# EAGLE design drutest2 (EAGLE 6.0)
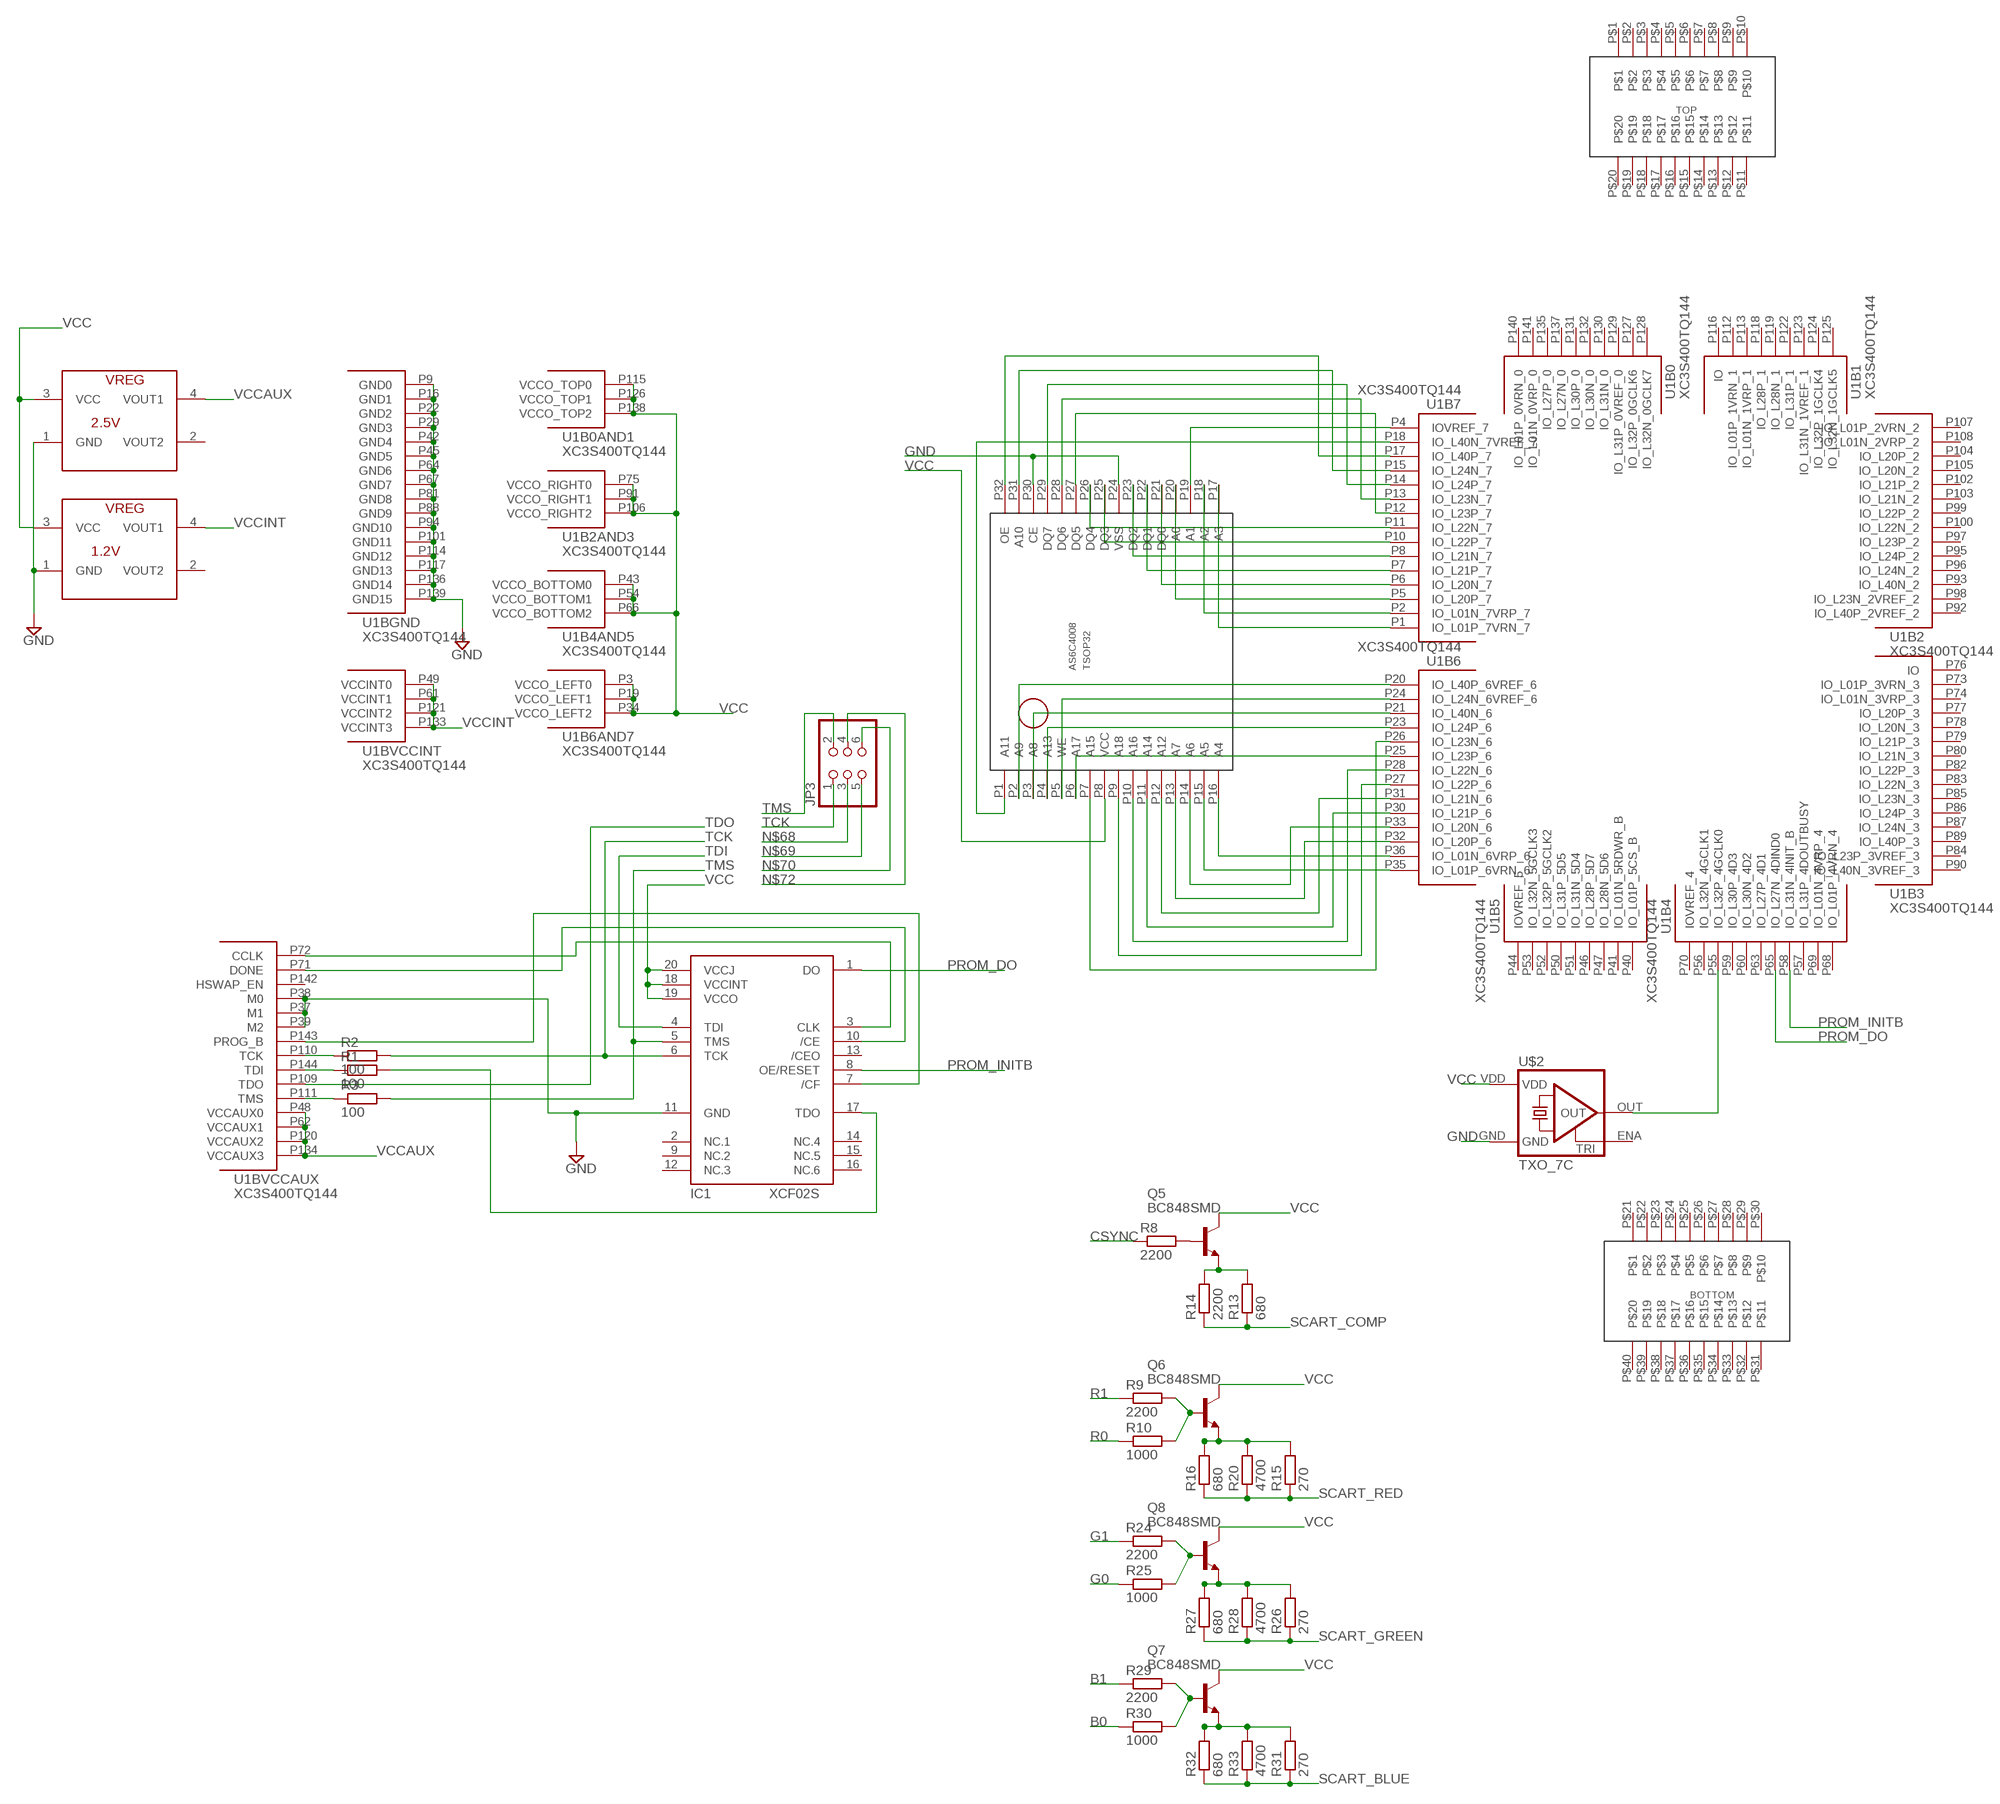
[diagram p0: schematic, sheet 1, part 1 of 2]
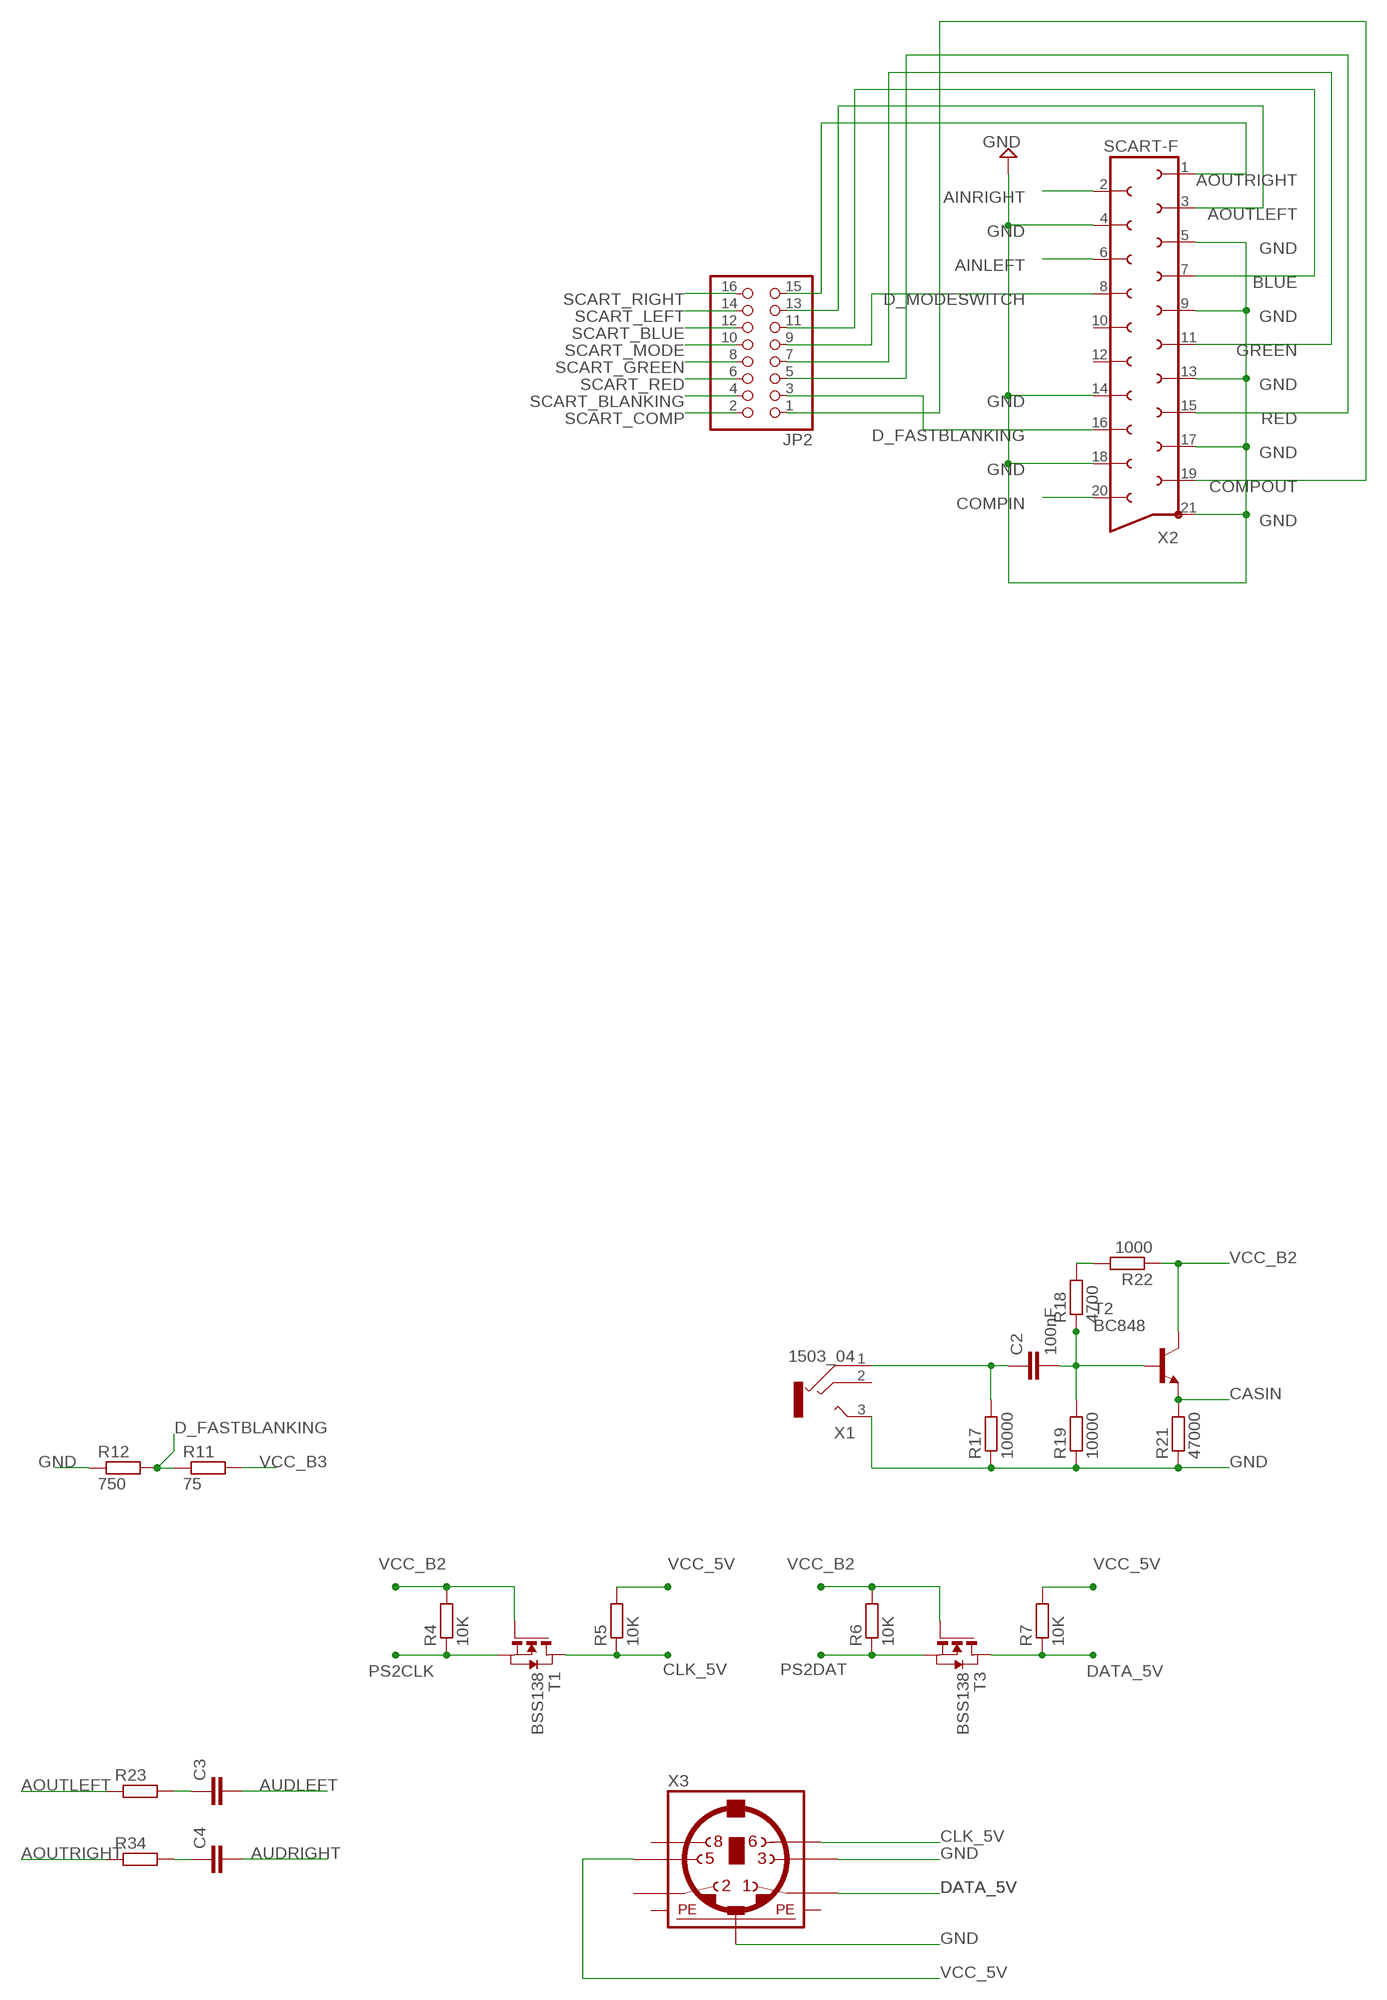
[diagram p1: schematic, sheet 1, part 2 of 2]

## Parts
C2  100nF  C-EUC0603  [C0603]
C3  C-EUC0603  [C0603]
C4  C-EUC0603  [C0603]
IC1  XCF02S  [VO20]
JP2  PINHD-2X8  [2X08]
JP3  PINHD-2X3  [2X03]
Q5  BC848SMD  [SOT23]
Q6  BC848SMD  [SOT23]
Q7  BC848SMD  [SOT23]
Q8  BC848SMD  [SOT23]
R1  100  R-EU_R0805  [R0805]
R2  100  R-EU_R0805  [R0805]
R3  100  R-EU_R0805  [R0805]
R4  10K  R-EU_R0805  [R0805]
R5  10K  R-EU_R0805  [R0805]
R6  10K  R-EU_R0805  [R0805]
R7  10K  R-EU_R0805  [R0805]
R8  2200  R-EU_R0805  [R0805]
R9  2200  R-EU_R0805  [R0805]
R10  1000  R-EU_R0805  [R0805]
R11  75  R-EU_R0805  [R0805]
R12  750  R-EU_R0805  [R0805]
R13  680  R-EU_R0805  [R0805]
R14  2200  R-EU_R0805  [R0805]
R15  270  R-EU_R0805  [R0805]
R16  680  R-EU_R0805  [R0805]
R17  10000  R-EU_R0805  [R0805]
R18  4700  R-EU_R0805  [R0805]
R19  10000  R-EU_R0805  [R0805]
R20  4700  R-EU_R0805  [R0805]
R21  47000  R-EU_R0805  [R0805]
R22  1000  R-EU_R0805  [R0805]
R23  R-EU_M0805  [M0805]
R24  2200  R-EU_R0805  [R0805]
R25  1000  R-EU_R0805  [R0805]
R26  270  R-EU_R0805  [R0805]
R27  680  R-EU_R0805  [R0805]
R28  4700  R-EU_R0805  [R0805]
R29  2200  R-EU_R0805  [R0805]
R30  1000  R-EU_R0805  [R0805]
R31  270  R-EU_R0805  [R0805]
R32  680  R-EU_R0805  [R0805]
R33  4700  R-EU_R0805  [R0805]
R34  R-EU_M0805  [M0805]
T1  BSS138  NMOSSOT23  [SOT-23]
T2  BC848  [SOT23]
T3  BSS138  NMOSSOT23  [SOT-23]
U1  XC3S400TQ144  [TQ144]
U$1  AS6C4008  [TSOP32]
U$2  TXO_7C  [OSC_7C]
U$3  2.5V  NX1117  [SOT223]
U$4  1.2V  NX1117  [SOT223]
U$5  EXPHDR  [EXPHDR]
X1  1503_04  [1503_04]
X2  SCART-F  [SCART-F]
X3  MINI_DIN_6  [M_DIN6]

## Nets
AINLEFT: X2.6
AINRIGHT: X2.2
AOUTLEFT: JP2.13 R23.1 X2.3
AOUTRIGHT: JP2.15 R34.1 X2.1
AUDLEFT: C3.2
AUDRIGHT: C4.2
B0: R30.1
B1: R29.1
BLUE: JP2.11 X2.7
CASIN: R21.2 T2.2(E)
CLK_5V: R5.1 T1.1(D) X3.6
COMPIN: X2.20
COMPOUT: JP2.1 X2.19
CSYNC: R8.1
D_FASTBLANKING: JP2.3 R11.1 R12.2 X2.16
D_MODESWITCH: JP2.9 X2.8
DATA_5V: R7.1 T3.1(D) X3.1
G0: R25.1
G1: R24.1
GND: IC1.11(GND) R12.1 R17.1 R19.1 R21.1 U1.P9(BGND:GND0) U1.P16(BGND:GND1) U1.P22(BGND:GND2) U1.P29(BGND:GND3) U1.P37(BVCCAUX:M1) U1.P38(BVCCAUX:M0) U1.P39(BVCCAUX:M2) U1.P42(BGND:GND4) U1.P45(BGND:GND5) U1.P64(BGND:GND6) U1.P67(BGND:GND7) U1.P81(BGND:GND8) U1.P88(BGND:GND9) U1.P94(BGND:GND10) U1.P101(BGND:GND11) U1.P114(BGND:GND12) U1.P117(BGND:GND13) U1.P136(BGND:GND14) U1.P139(BGND:GND15) U$1.P24(VSS) U$1.P30(CE) U$2.GND U$3.1(GND) U$4.1(GND) X1.3 X2.4 X2.5 X2.9 X2.13 X2.14 X2.17 X2.18 X2.21 X3.3 X3.SH2(PE2)
GREEN: JP2.7 X2.11
N$1: U1.P1(B7:IO_L01P_7VRN_7) U$1.P17(A3)
N$2: U1.P2(B7:IO_L01N_7VRP_7) U$1.P18(A2)
N$3: U1.P4(B7:IOVREF_7) U$1.P19(A1)
N$4: U1.P5(B7:IO_L20P_7) U$1.P20(A0)
N$5: U1.P6(B7:IO_L20N_7) U$1.P21(DQ0)
N$6: U1.P7(B7:IO_L21P_7) U$1.P22(DQ1)
N$7: U1.P8(B7:IO_L21N_7) U$1.P23(DQ2)
N$8: U1.P10(B7:IO_L22P_7) U$1.P25(DQ3)
N$9: U1.P11(B7:IO_L22N_7) U$1.P26(DQ4)
N$10: U1.P12(B7:IO_L23P_7) U$1.P27(DQ5)
N$11: U1.P13(B7:IO_L23N_7) U$1.P28(DQ6)
N$12: U1.P14(B7:IO_L24P_7) U$1.P29(DQ7)
N$13: U1.P15(B7:IO_L24N_7) U$1.P31(A10)
N$14: U1.P17(B7:IO_L40P_7) U$1.P32(OE)
N$15: U1.P18(B7:IO_L40N_7VREF_7) U$1.P1(A11)
N$16: U1.P20(B6:IO_L40P_6VREF_6) U$1.P2(A9)
N$17: U1.P21(B6:IO_L40N_6) U$1.P3(A8)
N$18: U1.P23(B6:IO_L24P_6) U$1.P4(A13)
N$19: U1.P24(B6:IO_L24N_6VREF_6) U$1.P5(WE)
N$20: U1.P25(B6:IO_L23P_6) U$1.P6(A17)
N$21: U1.P26(B6:IO_L23N_6) U$1.P7(A15)
N$22: U1.P27(B6:IO_L22P_6) U$1.P9(A18)
N$23: U1.P28(B6:IO_L22N_6) U$1.P10(A16)
N$24: U1.P30(B6:IO_L21P_6) U$1.P11(A14)
N$25: U1.P31(B6:IO_L21N_6) U$1.P12(A12)
N$26: U1.P32(B6:IO_L20P_6) U$1.P13(A7)
N$27: U1.P33(B6:IO_L20N_6) U$1.P14(A6)
N$28: U1.P35(B6:IO_L01P_6VRN_6) U$1.P15(A5)
N$29: U1.P36(B6:IO_L01N_6VRP_6) U$1.P16(A4)
N$35: IC1.3(CLK) U1.P72(BVCCAUX:CCLK)
N$36: IC1.17(TDO) R1.2
N$38: IC1.10(/CE) U1.P71(BVCCAUX:DONE)
N$39: R2.1 U1.P110(BVCCAUX:TCK)
N$40: IC1.7(/CF) U1.P143(BVCCAUX:PROG_B)
N$42: R1.1 U1.P144(BVCCAUX:TDI)
N$43: R3.1 U1.P111(BVCCAUX:TMS)
N$53: Q6.1(B) R9.2 R10.2
N$54: Q6.2(E) R15.2 R16.2 R20.2
N$55: Q8.1(B) R24.2 R25.2
N$56: Q8.2(E) R26.2 R27.2 R28.2
N$57: Q7.1(B) R29.2 R30.2
N$58: Q7.2(E) R31.2 R32.2 R33.2
N$59: Q5.2(E) R13.2 R14.2
N$60: C2.2 R18.1 R19.2 T2.1(B)
N$61: C2.1 R17.2 X1.1
N$62: R18.2 R22.2
N$63: Q5.1(B) R8.2
N$64: C3.1 R23.2
N$65: C4.1 R34.2
N$66: U1.P55(B4:IO_L32P_4GCLK0) U$2.OUT
N$68: JP3.3
N$69: JP3.5
N$70: JP3.6
N$72: JP3.4
PROM_DO: IC1.1(DO) U1.P65(B4:IO_L27N_4DIND0)
PROM_INITB: IC1.8(OE/RESET) U1.P58(B4:IO_L31N_4INIT_B)
PS2CLK: R4.1 T1.2(S)
PS2DAT: R6.1 T3.2(S)
R0: R10.1
R1: R9.1
RED: JP2.5 X2.15
SCART_BLANKING: JP2.4
SCART_BLUE: JP2.12 R31.1 R32.1 R33.1
SCART_COMP: JP2.2 R13.1 R14.1
SCART_GREEN: JP2.8 R26.1 R27.1 R28.1
SCART_LEFT: JP2.14
SCART_MODE: JP2.10
SCART_RED: JP2.6 R15.1 R16.1 R20.1
SCART_RIGHT: JP2.16
TCK: IC1.6(TCK) JP3.1 R2.2
TDI: IC1.4(TDI)
TDO: U1.P109(BVCCAUX:TDO)
TMS: IC1.5(TMS) JP3.2 R3.2
VCC: IC1.18(VCCINT) IC1.19(VCCO) IC1.20(VCCJ) Q5.3(C) Q6.3(C) Q7.3(C) Q8.3(C) U1.P3(B6AND7:VCCO_LEFT0) U1.P19(B6AND7:VCCO_LEFT1) U1.P34(B6AND7:VCCO_LEFT2) U1.P43(B4AND5:VCCO_BOTTOM0) U1.P54(B4AND5:VCCO_BOTTOM1) U1.P66(B4AND5:VCCO_BOTTOM2) U1.P75(B2AND3:VCCO_RIGHT0) U1.P91(B2AND3:VCCO_RIGHT1) U1.P106(B2AND3:VCCO_RIGHT2) U1.P115(B0AND1:VCCO_TOP0) U1.P126(B0AND1:VCCO_TOP1) U1.P138(B0AND1:VCCO_TOP2) U$1.P8(VCC) U$2.VDD U$3.3(VCC) U$4.3(VCC)
VCC_5V [power]: R5.2 R7.2 X3.5
VCC_B2: R4.2 R6.2 R22.1 T1.3(G) T2.3(C) T3.3(G)
VCC_B3: R11.2
VCCAUX: U1.P48(BVCCAUX:VCCAUX0) U1.P62(BVCCAUX:VCCAUX1) U1.P120(BVCCAUX:VCCAUX2) U1.P134(BVCCAUX:VCCAUX3) U$3.4(VOUT1)
VCCINT: U1.P49(BVCCINT:VCCINT0) U1.P61(BVCCINT:VCCINT1) U1.P121(BVCCINT:VCCINT2) U1.P133(BVCCINT:VCCINT3) U$4.4(VOUT1)
Unconnected: IC1.2(NC.1) IC1.9(NC.2) IC1.12(NC.3) IC1.13(/CEO) IC1.14(NC.4) IC1.15(NC.5) IC1.16(NC.6) U1.P40(B5:IO_L01P_5CS_B) U1.P41(B5:IO_L01N_5RDWR_B) U1.P44(B5:IOVREF_5) U1.P46(B5:IO_L28P_5D7) U1.P47(B5:IO_L28N_5D6) U1.P50(B5:IO_L31P_5D5) U1.P51(B5:IO_L31N_5D4) U1.P52(B5:IO_L32P_5GCLK2) U1.P53(B5:IO_L32N_5GCLK3) U1.P56(B4:IO_L32N_4GCLK1) U1.P57(B4:IO_L31P_4DOUTBUSY) U1.P59(B4:IO_L30P_4D3) U1.P60(B4:IO_L30N_4D2) U1.P63(B4:IO_L27P_4D1) U1.P68(B4:IO_L01P_4VRN_4) U1.P69(B4:IO_L01N_4VRP_4) U1.P70(B4:IOVREF_4) U1.P73(B3:IO_L01P_3VRN_3) U1.P74(B3:IO_L01N_3VRP_3) U1.P76(B3:IO) U1.P77(B3:IO_L20P_3) U1.P78(B3:IO_L20N_3) U1.P79(B3:IO_L21P_3) U1.P80(B3:IO_L21N_3) U1.P82(B3:IO_L22P_3) U1.P83(B3:IO_L22N_3) U1.P84(B3:IO_L23P_3VREF_3) U1.P85(B3:IO_L23N_3) U1.P86(B3:IO_L24P_3) U1.P87(B3:IO_L24N_3) U1.P89(B3:IO_L40P_3) U1.P90(B3:IO_L40N_3VREF_3) U1.P92(B2:IO_L40P_2VREF_2) U1.P93(B2:IO_L40N_2) U1.P95(B2:IO_L24P_2) U1.P96(B2:IO_L24N_2) U1.P97(B2:IO_L23P_2) U1.P98(B2:IO_L23N_2VREF_2) U1.P99(B2:IO_L22P_2) U1.P100(B2:IO_L22N_2) U1.P102(B2:IO_L21P_2) U1.P103(B2:IO_L21N_2) U1.P104(B2:IO_L20P_2) U1.P105(B2:IO_L20N_2) U1.P107(B2:IO_L01P_2VRN_2) U1.P108(B2:IO_L01N_2VRP_2) U1.P112(B1:IO_L01P_1VRN_1) U1.P113(B1:IO_L01N_1VRP_1) U1.P116(B1:IO) U1.P118(B1:IO_L28P_1) U1.P119(B1:IO_L28N_1) U1.P122(B1:IO_L31P_1) U1.P123(B1:IO_L31N_1VREF_1) U1.P124(B1:IO_L32P_1GCLK4) U1.P125(B1:IO_L32N_1GCLK5) U1.P127(B0:IO_L32P_0GCLK6) U1.P128(B0:IO_L32N_0GCLK7) U1.P129(B0:IO_L31P_0VREF_0) U1.P130(B0:IO_L31N_0) U1.P131(B0:IO_L30P_0) U1.P132(B0:IO_L30N_0) U1.P135(B0:IO_L27P_0) U1.P137(B0:IO_L27N_0) U1.P140(B0:IO_L01P_0VRN_0) U1.P141(B0:IO_L01N_0VRP_0) U1.P142(BVCCAUX:HSWAP_EN) U$2.ENA(TRI) U$3.2(VOUT2) U$4.2(VOUT2) U$5.P$1 U$5.P$2 U$5.P$3 U$5.P$4 U$5.P$5 U$5.P$6 U$5.P$7 U$5.P$8 U$5.P$9 U$5.P$10 U$5.P$11 U$5.P$12 U$5.P$13 U$5.P$14 U$5.P$15 U$5.P$16 U$5.P$17 U$5.P$18 U$5.P$19 U$5.P$20 U$5.P$21 U$5.P$22 U$5.P$23 U$5.P$24 U$5.P$25 U$5.P$26 U$5.P$27 U$5.P$28 U$5.P$29 U$5.P$30 U$5.P$31 U$5.P$32 U$5.P$33 U$5.P$34 U$5.P$35 U$5.P$36 U$5.P$37 U$5.P$38 U$5.P$39 U$5.P$40 X1.2 X2.10 X2.12 X3.2 X3.8

## Power pins joined to a net without a drawn wire
PE1: X3.SH1(PE1)
PE3: X3.SH3(PE3)

## Library data of the parts
C2-C4 = resistor:C-EU: CAPACITOR, European symbol
IC1 = smd-special:XCF02S
JP2 = pinhead:PINHD-2X8: PIN HEADER
JP3 = pinhead:PINHD-2X3: PIN HEADER
Q5-Q8 = bc548:BC848*: NPN Transistor
R1-R22 R24-R33 = rcl:R-EU_: RESISTOR, European symbol
R23 R34 = resistor:R-EU_: RESISTOR, European symbol
T1 T3 = zetex:NMOSSOT23: MOS FET; OC_FARNELL: unknown; OC_NEWARK: unknown
T2 = transistor:BC848: NPN TRANSISTOR
U1 = xilinx_spartan3_virtex4_and_5:XC3S400TQ144: Xilinx FPGA
U$1 = cpcfpga:AS6C4008
U$2 = cpcfpga:TXO_7C: TXC crystal oscillator http://www.txccrystal.com/images/pdf/7c.pdf
U$3 U$4 = cpcfpga:NX1117
U$5 = cpcfpga:EXPHDR
X1 = con-lumberg:1503_04: Jack connectors according to JISC 6560, 3.5 mm, IP 57 Klinkensteckverbinder nach JISC 6560, 3,5 mm, IP 57 Source: http://www.lumberg.com/Produkte/PDFs/1503_04.pdf; OC_FARNELL: 1216981; OC_NEWARK: unknown
X2 = con-hirschmann:SCART-F: TV SCART CONNECTOR; OC_FARNELL: unknown; OC_NEWARK: unknown
X3 = mini_din:MINI_DIN_6

## Net classes
1 power: width 0.6 mm, drill 1.1 mm, clearance 0.4 mm

## Board
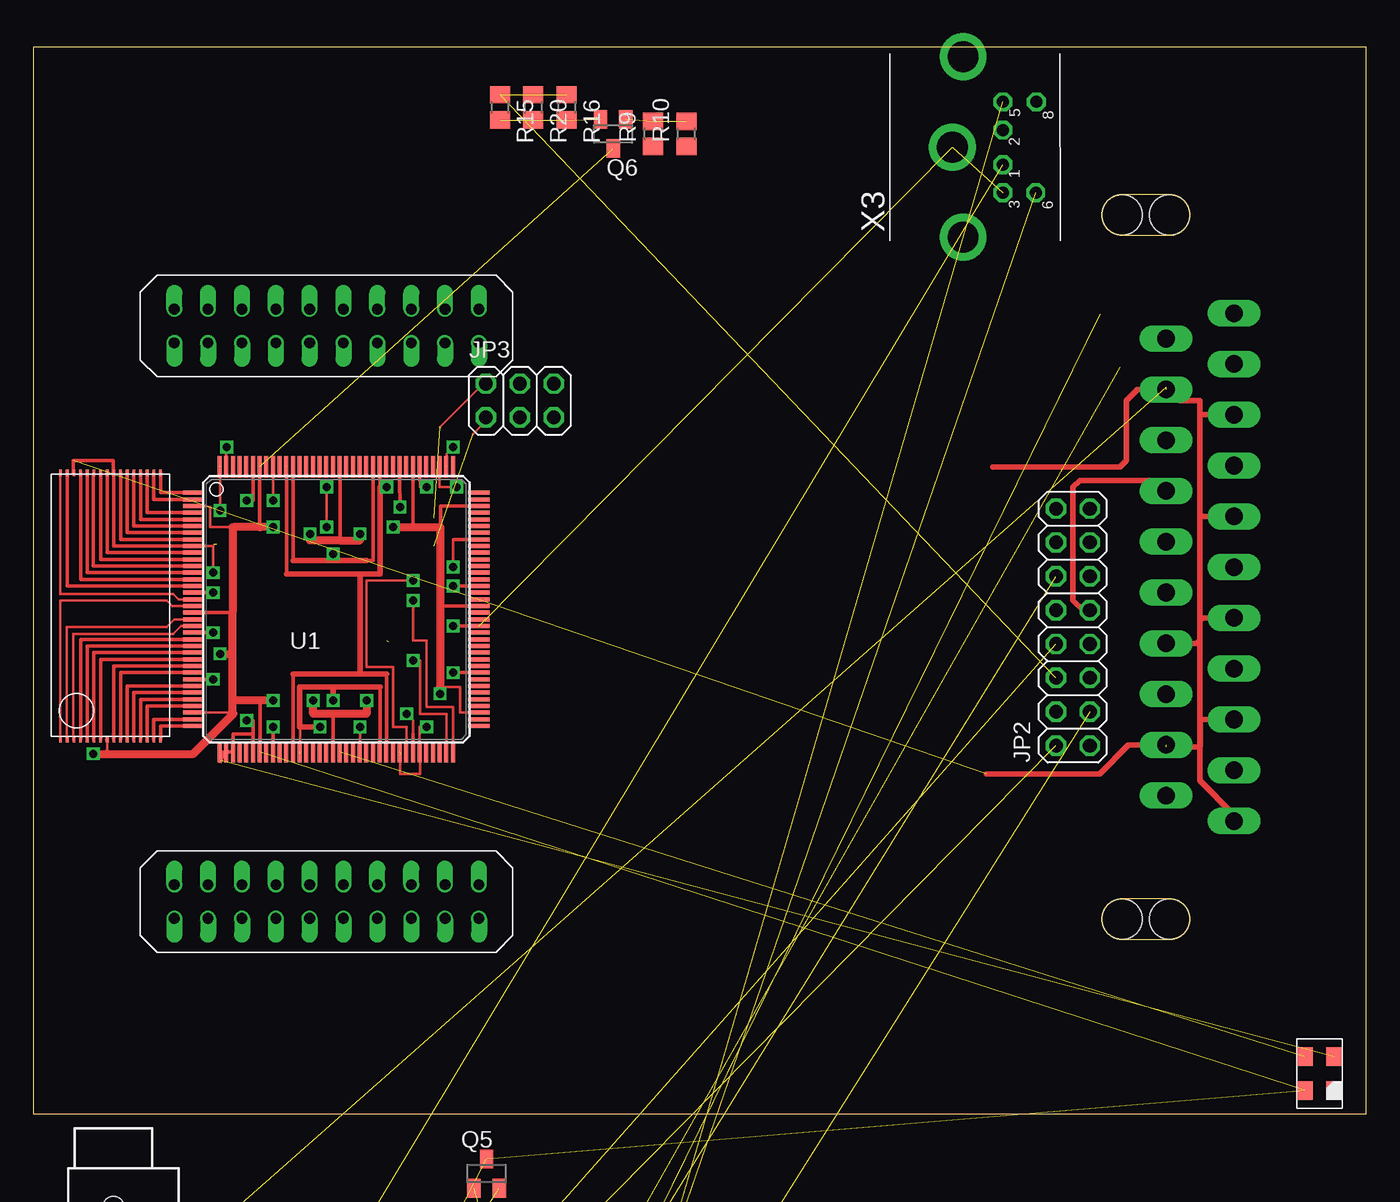
[diagram p2: board, top side]
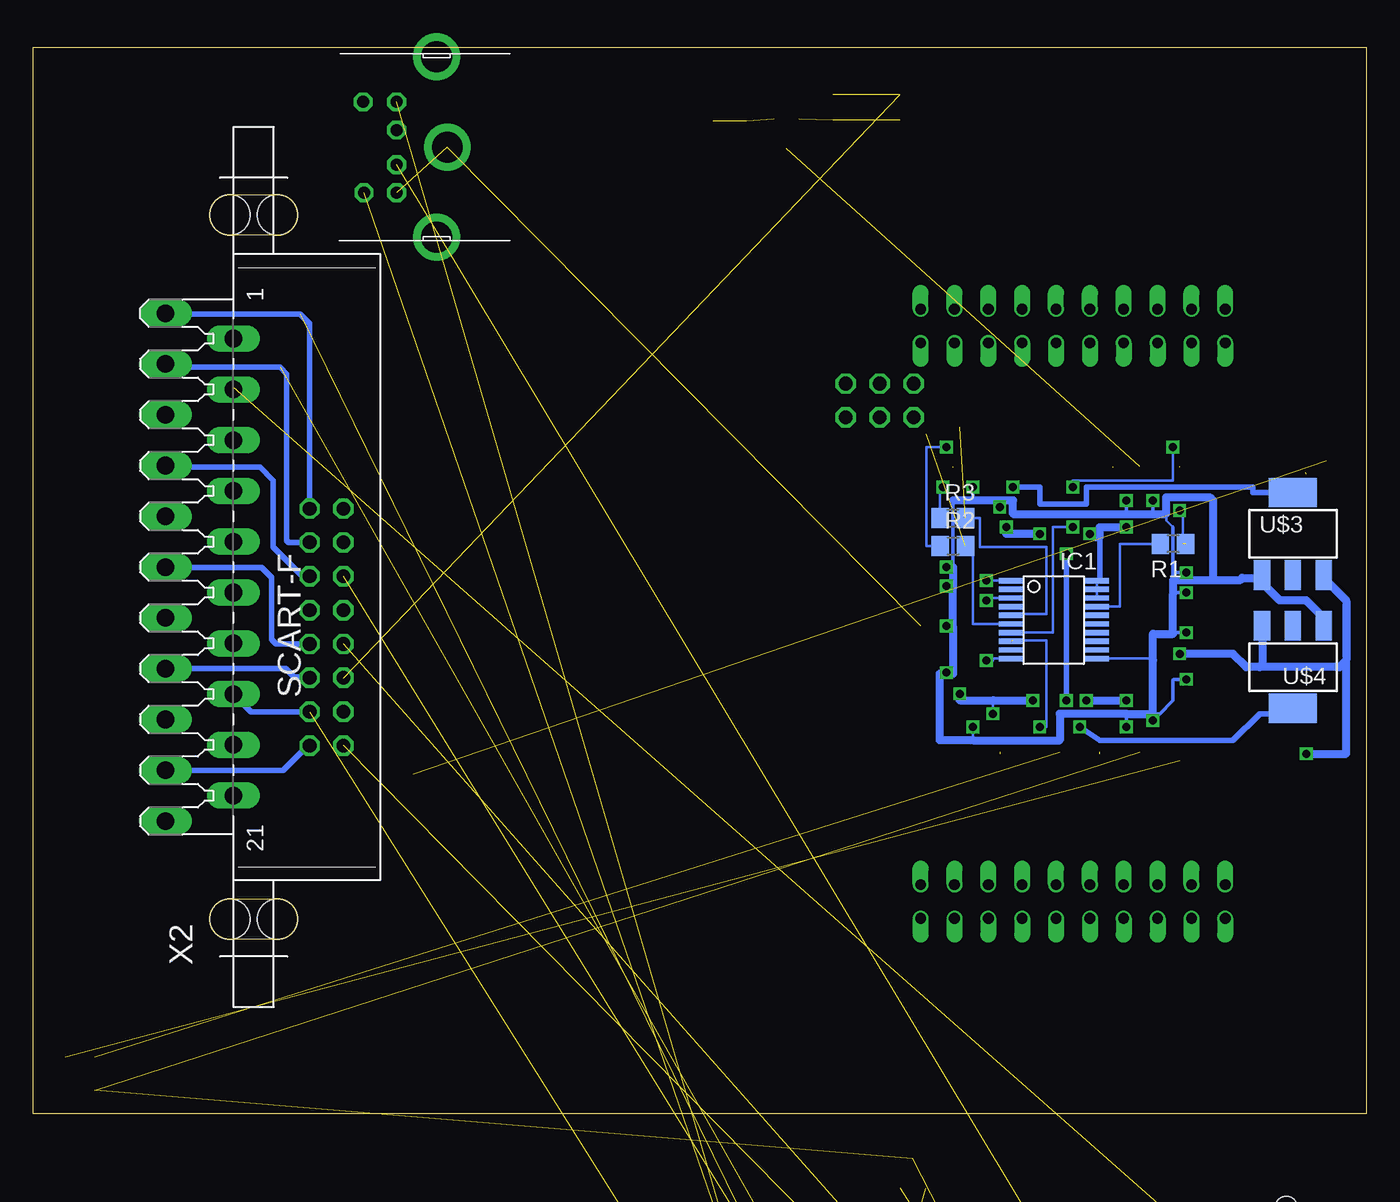
[diagram p3: board, bottom side, seen from below]

Size 100 x 80 mm. Coordinates in mm from the lower left corner, seen from the top.
Outline: 0,0 100,0 100,80 0,80 0,0
Copper layers (1*16): Top 0.0356mm / dielectric 1.5011mm / Bottom 0.0356mm
Design rules: minimum track width 6mil, minimum drill 13mil, track to track 6mil, track to pad 6mil, pad to pad 6mil, via to via 6mil, smd to smd 6mil, copper to edge 15mil, drill to drill 6mil, minimum pad ring 7mil, minimum via ring 7mil, stop-mask expansion 4mil, vias tented up to drill 0mil, thermal gap 10mil

### Footprints (pad centres in the part's own frame; a part is rotated, then mirrored left to right if it is on the bottom)
C0603 = smd 1.1 x 1: 1 -0.85,0; 2 0.85,0
VO20 = smd 0.4 x 1.8: 1 5.85,6.15; 2 5.2,6.15; 3 4.55,6.15; 4 3.9,6.15; 5 3.25,6.15; 6 2.6,6.15; 7 1.95,6.15; 8 1.3,6.15; 9 0.65,6.15; 10 0,6.15; 11 0,-0.3; 12 0.65,-0.3; 13 1.3,-0.3; 14 1.95,-0.3; 15 2.6,-0.3; 16 3.25,-0.3; 17 3.9,-0.3; 18 4.55,-0.3; 19 5.2,-0.3; 20 5.85,-0.3
2X08 = drill 1.016 octagon: 1 -8.89,-1.27; 2 -8.89,1.27; 3 -6.35,-1.27; 4 -6.35,1.27; 5 -3.81,-1.27; 6 -3.81,1.27; 7 -1.27,-1.27; 8 -1.27,1.27; 9 1.27,-1.27; 10 1.27,1.27; 11 3.81,-1.27; 12 3.81,1.27; 13 6.35,-1.27; 14 6.35,1.27; 15 8.89,-1.27; 16 8.89,1.27
2X03 = drill 1.016 octagon: 1 -2.54,-1.27; 2 -2.54,1.27; 3 0,-1.27; 4 0,1.27; 5 2.54,-1.27; 6 2.54,1.27
SOT23 = smd 1 x 1.4: 1 -0.95,-1.1; 2 0.95,-1.1; 3 0,1.1
R0805 = smd 1.3 x 1.5: 1 -0.95,0; 2 0.95,0
M0805 = smd 1.3 x 1.6: 1 -0.95,0; 2 0.95,0
SOT-23 = smd 0.787 x 0.889: 1 0.025,-1.016; 2 -0.94,1.016; 3 0.991,1.016
TQ144 = smd 1.6 x 0.3: P1 -10.7,8.75; P2 -10.7,8.25; P3 -10.7,7.75; P4 -10.7,7.25; P5 -10.7,6.75; P6 -10.7,6.25; P7 -10.7,5.75; P8 -10.7,5.25; P9 -10.7,4.75; P10 -10.7,4.25; P11 -10.7,3.75; P12 -10.7,3.25; P13 -10.7,2.75; P14 -10.7,2.25; P15 -10.7,1.75; P16 -10.7,1.25; P17 -10.7,0.75; P18 -10.7,0.25; P19 -10.7,-0.25; P20 -10.7,-0.75; P21 -10.7,-1.25; P22 -10.7,-1.75; P23 -10.7,-2.25; P24 -10.7,-2.75; P25 -10.7,-3.25; P26 -10.7,-3.75; P27 -10.7,-4.25; P28 -10.7,-4.75; P29 -10.7,-5.25; P30 -10.7,-5.75; P31 -10.7,-6.25; P32 -10.7,-6.75; P33 -10.7,-7.25; P34 -10.7,-7.75; P35 -10.7,-8.25; P36 -10.7,-8.75; P73 10.7,-8.75; P74 10.7,-8.25; P75 10.7,-7.75; P76 10.7,-7.25; P77 10.7,-6.75; P78 10.7,-6.25; P79 10.7,-5.75; P80 10.7,-5.25; P81 10.7,-4.75; P82 10.7,-4.25; P83 10.7,-3.75; P84 10.7,-3.25; P85 10.7,-2.75; P86 10.7,-2.25; P87 10.7,-1.75; P88 10.7,-1.25; P89 10.7,-0.75; P90 10.7,-0.25; P91 10.7,0.25; P92 10.7,0.75; P93 10.7,1.25; P94 10.7,1.75; P95 10.7,2.25; P96 10.7,2.75; P97 10.7,3.25; P98 10.7,3.75; P99 10.7,4.25; P100 10.7,4.75; P101 10.7,5.25; P102 10.7,5.75; P103 10.7,6.25; P104 10.7,6.75; P105 10.7,7.25; P106 10.7,7.75; P107 10.7,8.25; P108 10.7,8.75 | smd 0.3 x 1.6: P37 -8.75,-10.7; P38 -8.25,-10.7; P39 -7.75,-10.7; P40 -7.25,-10.7; P41 -6.75,-10.7; P42 -6.25,-10.7; P43 -5.75,-10.7; P44 -5.25,-10.7; P45 -4.75,-10.7; P46 -4.25,-10.7; P47 -3.75,-10.7; P48 -3.25,-10.7; P49 -2.75,-10.7; P50 -2.25,-10.7; P51 -1.75,-10.7; P52 -1.25,-10.7; P53 -0.75,-10.7; P54 -0.25,-10.7; P55 0.25,-10.7; P56 0.75,-10.7; P57 1.25,-10.7; P58 1.75,-10.7; P59 2.25,-10.7; P60 2.75,-10.7; P61 3.25,-10.7; P62 3.75,-10.7; P63 4.25,-10.7; P64 4.75,-10.7; P65 5.25,-10.7; P66 5.75,-10.7; P67 6.25,-10.7; P68 6.75,-10.7; P69 7.25,-10.7; P70 7.75,-10.7; P71 8.25,-10.7; P72 8.75,-10.7; P109 8.75,10.7; P110 8.25,10.7; P111 7.75,10.7; P112 7.25,10.7; P113 6.75,10.7; P114 6.25,10.7; P115 5.75,10.7; P116 5.25,10.7; P117 4.75,10.7; P118 4.25,10.7; P119 3.75,10.7; P120 3.25,10.7; P121 2.75,10.7; P122 2.25,10.7; P123 1.75,10.7; P124 1.25,10.7; P125 0.75,10.7; P126 0.25,10.7; P127 -0.25,10.7; P128 -0.75,10.7; P129 -1.25,10.7; P130 -1.75,10.7; P131 -2.25,10.7; P132 -2.75,10.7; P133 -3.25,10.7; P134 -3.75,10.7; P135 -4.25,10.7; P136 -4.75,10.7; P137 -5.25,10.7; P138 -5.75,10.7; P139 -6.25,10.7; P140 -6.75,10.7; P141 -7.25,10.7; P142 -7.75,10.7; P143 -8.25,10.7; P144 -8.75,10.7
TSOP32 = smd 0.5 x 0.2: P1 -9.75,3.75; P2 -9.75,3.25; P3 -9.75,2.75; P4 -9.75,2.25; P5 -9.75,1.75; P6 -9.75,1.25; P7 -9.75,0.75; P8 -9.75,0.25; P9 -9.75,-0.25; P10 -9.75,-0.75; P11 -9.75,-1.25; P12 -9.75,-1.75; P13 -9.75,-2.25; P14 -9.75,-2.75; P15 -9.75,-3.25; P16 -9.75,-3.75; P17 10.25,-3.75; P18 10.25,-3.25; P19 10.25,-2.75; P20 10.25,-2.25; P21 10.25,-1.75; P22 10.25,-1.25; P23 10.25,-0.75; P24 10.25,-0.25; P25 10.25,0.25; P26 10.25,0.75; P27 10.25,1.25; P28 10.25,1.75; P29 10.25,2.25; P30 10.25,2.75; P31 10.25,3.25; P32 10.25,3.75
OSC_7C = smd 1.4 x 1.2: ENA -1.27,-1.1; GND 1.27,-1.1; OUT 1.27,1.1; VDD -1.27,1.1
SOT223 = smd 1.219 x 2.235: 1 -2.311,-3.099; 2 0,-3.099; 3 2.311,-3.099 | smd 3.6 x 2.2: 4 0,3.099
EXPHDR = drill 0.8 offset: P$1 -11.43,-20.32; P$2 -8.89,-20.32; P$3 -6.35,-20.32; P$4 -3.81,-20.32; P$5 -1.27,-20.32; P$6 -11.43,22.86; P$7 -8.89,22.86; P$8 -6.35,22.86; P$9 -3.81,22.86; P$10 -1.27,22.86; P$11 1.27,22.86; P$12 3.81,22.86; P$13 6.35,22.86; P$14 8.89,22.86; P$15 11.43,22.86; P$16 1.27,-20.32; P$17 3.81,-20.32; P$18 6.35,-20.32; P$19 8.89,-20.32; P$20 11.43,-20.32; P$21 -11.43,-22.86; P$22 -8.89,-22.86; P$23 -6.35,-22.86; P$24 -3.81,-22.86; P$25 -1.27,-22.86; P$26 -11.43,20.32; P$27 -8.89,20.32; P$28 -6.35,20.32; P$29 -3.81,20.32; P$30 -1.27,20.32; P$31 1.27,20.32; P$32 3.81,20.32; P$33 6.35,20.32; P$34 8.89,20.32; P$35 11.43,20.32; P$36 1.27,-22.86; P$37 3.81,-22.86; P$38 6.35,-22.86; P$39 8.89,-22.86; P$40 11.43,-22.86
1503_04 = drill 0.8 pad 1.2 long: 1 3.9,-10.25; 2 0.65,-10.25 | drill 1 pad 1.2 long: 3 -2.3,-10.25 | hole 1.6: 0,0
SCART-F = drill 1.321 long: 1 19.05,5.08; 2 17.145,0; 3 15.24,5.08; 4 13.335,0; 5 11.43,5.08; 6 9.525,0; 7 7.62,5.08; 8 5.715,0; 9 3.81,5.08; 10 1.905,0; 11 0,5.08; 12 -1.905,0; 13 -3.81,5.08; 14 -5.715,0; 15 -7.62,5.08; 16 -9.525,0; 17 -11.43,5.08; 18 -13.335,0; 19 -15.24,5.08; 20 -17.145,0; 21 -19.05,5.08 | hole 3.023: 26.416,0.254; 26.416,-3.302; -26.416,0.254; -26.416,-3.302
M_DIN6 = drill 0.9 pad 1.422 octagon: 1 -1.3,-3.75; 2 1.3,-3.75; 3 -3.4,-3.75; 5 3.4,-3.75; 6 -3.4,-6.2; 8 3.4,-6.25 | drill 2.3 pad 3.5: SH1 6.8,-0.75; SH2 0,0.05; SH3 -6.75,-0.75

### Placement (x,y rotation side)
C2  12,-56 0 top  (outside the outline)
C3  28.5,-56 0 top  (outside the outline)
C4  32,-56 0 top  (outside the outline)
IC1  20.52,34.13 90 bottom
JP2  78,36.5 90 top
JP3  36.5,53.5 0 top
Q5  34,-4.5 0 top  (outside the outline)
Q6  43.5,73.5 180 top
Q7  13.5,-23 0 top  (outside the outline)
Q8  24.5,-23 0 top  (outside the outline)
R1  14.49,42.75 180 bottom
R2  31,42.58 0 bottom
R3  31.01,44.68 0 bottom
R4  29.5,-50 0 top  (outside the outline)
R5  35,-50 0 top  (outside the outline)
R6  40.5,-50 0 top  (outside the outline)
R7  2,-56.5 0 top  (outside the outline)
R8  39,-30 0 top  (outside the outline)
R9  46.5,73.5 90 top
R10  49,73.5 90 top
R11  7.5,-56.5 0 top  (outside the outline)
R12  32,-43.5 0 top  (outside the outline)
R13  37.5,-43.5 0 top  (outside the outline)
R14  14,-37 0 top  (outside the outline)
R15  35,75.5 270 top
R16  40,75.5 270 top
R17  18,-30 0 top  (outside the outline)
R18  20,-37 0 top  (outside the outline)
R19  25,-30 0 top  (outside the outline)
R20  37.5,75.5 270 top
R21  32,-30 0 top  (outside the outline)
R22  32,-37 0 top  (outside the outline)
R23  19,-56 0 top  (outside the outline)
R24  38,-37 0 top  (outside the outline)
R25  2,-43.5 0 top  (outside the outline)
R26  7.5,-50 0 top  (outside the outline)
R27  13,-50 0 top  (outside the outline)
R28  8,-43.5 0 top  (outside the outline)
R29  14,-43.5 0 top  (outside the outline)
R30  20,-43.5 0 top  (outside the outline)
R31  18.5,-50 0 top  (outside the outline)
R32  24,-50 0 top  (outside the outline)
R33  26,-43.5 0 top  (outside the outline)
R34  24,-56 0 top  (outside the outline)
T1  2,-32 0 top  (outside the outline)
T2  35.5,-23 0 top  (outside the outline)
T3  10,-32 0 top  (outside the outline)
U1  22.73,37.83 0 top
U$1  5.79,37.83 90 top
U$2  96.5,3 90 top
U$3  5.5,43.5 0 bottom
U$4  5.5,33.5 180 bottom
U$5  22,37.5 0 top
X1  6,-7 0 top  (outside the outline)
X2  85,41 90 bottom
X3  69,72.5 90 top

### Tracks (layer width: path | path; a pad name or v marks a point on that pad's centre or on a via)
AOUTLEFT  (1 unrouted)
  Bottom 0.406: JP2.13 80.85,42.85 81,43 81,55.5 81.5,56 89.84,56 X2.3
AOUTRIGHT  (1 unrouted)
  Bottom 0.406: JP2.15 79.27,59.27 80,60 89.53,60 X2.1
BLUE
  Bottom 0.406: JP2.11 79.81,40.31 82,42.5 82,47.5 83,48.5 89.96,48.5 X2.7
CASIN  (1 unrouted)
CLK_5V  (2 unrouted)
COMPOUT
  Bottom 0.406: JP2.1 79.39,27.61 81.24,25.76 X2.19
D_FASTBLANKING  (2 unrouted)
  Bottom 0.406: JP2.3 83.67,30.15 X2.16
D_MODESWITCH
  Top 0.406: JP2.9 78.73,37.77 78,38.5 78,47 78.5,47.5 84.22,47.5 X2.8
DATA_5V  (2 unrouted)
GND  (via drill 0.6)  (12 unrouted)
  Top 0.2: 28.98,27.48 29,27.48 29,25.5 27.5,25.5 27.5,27 | U1.P9 13.5,42.58 v13.5,40.58 | v29.5,29 28.98,29 U1.P67 | 31.58,43.08 31.5,43.08 v31.5,41 | 28.98,47.52 29,47.52 29,47 v29.5,47 | U1.P136 17.98,46.02 v18,46
  Top 0.254: U1.P9 6.04,42.58 U$1.P24 6,48.08 6,49 3,49 3,48.08 U$1.P30 | U1.P139 16.5,48.53 16.5,46 v16,46 | U1.P16 v13.5,39.08 | 13.56,40.58 v13.5,40.58 | U1.P22 v13.5,36.08 | U1.P29 v13.5,32.58 | U1.P94 v31.5,39.58 | U1.P81 v31.5,33.08 | U1.P88 v31.5,36.58 | U1.P45 18,27.13 v18,29 | U1.P42 16.5,27.13 16.5,28.5 | 16.5,28.5 16.5,29.5 v16,29.5 | U1.P37 U1.P38 U1.P39 14.97,28.48 15,28.5 16.5,28.5 | U1.P114 28.98,47.52 | U1.P117 27.48,47.52 v27.5,45.5 | U1.P101 31.58,43.08 | U1.P67 28.98,27.48
  Top 0.406: X2.18 82.17,27.66 80,25.5 71.5,25.5 | X2.4 82.83,54.34 82,53.5 82,49 81.5,48.5 72,48.5 | 14,26.5 14,26.66 U1.P38 | X2.21 90.08,22.42 87.5,25 87.5,27.5 | 87.5,27.5 87.5,29.5 | 87.5,29.5 87.5,35.5 | 87.5,35.5 87.5,37 | 87.5,37 87.5,45 | 87.5,45 87.5,52.5 | 87.5,52.5 87.5,53.5 86,53.5 85,54.5 | 87.5,29.5 87.57,29.57 87.57,29.5 | X2.14 87.28,35.28 87.5,35.5 | X2.13 87.69,37.19 87.5,37 | X2.9 87.69,44.81 87.5,45 | 87.57,29.5 87.57,27.57 87.5,27.5 | 87.5,27.5 85,27.5 | X2.17 87.64,29.57 87.57,29.5 | X2.5 87.57,52.43 87.5,52.5
  Bottom 0.2: 14.42,32.58 14.5,32.58 14.5,32.5 | v31.5,41 31,41 | v27.5,45.5 27.5,46 | 29.5,28 v29.5,29 | IC1.11 16,34.13 16,34 | 14.5,44 15,44.5 15,45
  Bottom 0.254: v13.5,40.58 14.49,40.58 | 14.49,40.58 14.5,42.5 14.5,40 | v13.5,39.08 14.42,39.08 14.5,39 | v13.5,36.08 14.42,36.08 14.5,36 | v13.5,32.58 14.42,32.58 | 14.5,32.5 14.5,31 15.5,30 16,30 v16,29.5 | v18,29 18,30 | 14.5,44 14.5,42.66 14.49,40.58 | 16,45 v16,46 | v18,46 18,45 | v29.5,47 29.5,46 | 31,46 31,41 | v31.5,39.58 31.08,39.58 31,39.5 | v31.5,36.58 31.08,36.58 31,36.5 | v31.5,33.08 31.08,33.08 31,33
  Bottom 0.4: 7.81,40.19 U$3.1 7.5,40.09 7.5,39.5 | U$4.1 3.19,37.19
  Bottom 0.6: 31,46 29.5,46 27.5,46 26.5,46 26.5,45 18,45 16,45 15,45 15,46.25 11.75,46.25 11.5,46 11.5,40 | 31,41 31,39.5 31,36.5 31,33 32,33 32,28 29.5,28 23,28 23,30 18,30 16,30 16,34 16,36 14.5,36 14.5,39 14.5,40 11.5,40 | 11.5,40 9.5,40 9.31,40.19 7.81,40.19 | 3.19,37.19 4.5,38.5 6.5,38.5 7.5,39.5
GREEN
  Bottom 0.406: JP2.7 81.78,35.23 82.11,35.56 82.11,40.21 82.88,40.98 90.06,40.98 X2.11
N$1
  Top 0.254: U1.P1 9.54,46.58 U$1.P17
N$2
  Top 0.254: U1.P2 9.04,46.08 U$1.P18
N$3
  Top 0.254: U1.P4 8.54,45.08 U$1.P19
N$4
  Top 0.254: U1.P5 8.04,44.58 U$1.P20
N$5
  Top 0.254: U1.P6 7.54,44.08 U$1.P21
N$6
  Top 0.254: U1.P7 7.04,43.58 U$1.P22
N$7
  Top 0.254: U1.P8 6.54,43.08 U$1.P23
N$8
  Top 0.254: U1.P10 5.54,42.08 U$1.P25
N$9
  Top 0.254: U1.P11 5.04,41.58 U$1.P26
N$10  (1 unrouted)
  Top 0.254: U1.P12 4.5,41.08 4.5,48
N$11
  Top 0.254: U1.P13 4.04,40.58 U$1.P28
N$12
  Top 0.254: U1.P14 3.54,40.08 U$1.P29
N$13
  Top 0.254: U1.P15 2.54,39.58 U$1.P31
N$14
  Top 0.2: U1.P17 10.92,38.58 10.5,39 2,39 2,48.08 U$1.P32
N$15
  Top 0.2: U1.P18 10.42,38.08 10,38.5 2,38.5 2,28.08 U$1.P1
N$16
  Top 0.2: U1.P20 10.58,37.08 10,36.5 2.5,36.5 2.5,28.08 U$1.P2
N$17
  Top 0.2: U$1.P3 3,28.08 3,36 10.5,36 11.08,36.58 U1.P21
N$18
  Top 0.254: U1.P23 3.54,35.58 U$1.P4
N$19
  Top 0.254: U1.P24 4.04,35.08 U$1.P5
N$20
  Top 0.254: U1.P25 4.54,34.58 U$1.P6
N$21
  Top 0.254: U1.P26 5.04,34.08 U$1.P7
N$22
  Top 0.254: U1.P27 6.04,33.58 U$1.P9
N$23
  Top 0.254: U1.P28 6.54,33.08 U$1.P10
N$24
  Top 0.254: U1.P30 7.04,32.08 U$1.P11
N$25
  Top 0.254: U1.P31 7.54,31.58 U$1.P12
N$26
  Top 0.254: U1.P32 8.04,31.08 U$1.P13
N$27
  Top 0.254: U1.P33 8.54,30.58 U$1.P14
N$28
  Top 0.254: U1.P35 9.04,29.58 U$1.P15
N$29
  Top 0.254: U1.P36 9.54,29.08 U$1.P16
N$35  (via drill 0.6)
  Top 0.2: U1.P72 31.5,27.13 31.5,30.5 29.5,30.5 29.5,35.5 28.5,35.5 v28.5,38.5
  Bottom 0.2: IC1.3 28.5,38.68 v28.5,38.5
N$36
  Bottom 0.2: IC1.17 18.5,38.03 18.5,42.75 R1.2
N$38  (via drill 0.6)
  Top 0.2: U1.P71 31,27.13 31,30 29,30 29,34 v28.5,34
  Bottom 0.2: v28.5,34 28,34 28,34.13 IC1.10
N$39  (via drill 0.6)  (1 unrouted)
  Top 0.2: 31,48.5 31,49.5 v31.5,50
  Bottom 0.2: R2.1 33,42.58 33,50 v31.5,50
N$40  (via drill 0.6)
  Top 0.2: v22,44 v22,47 | U1.P143 14.47,49.98 v14.5,50
  Bottom 0.2: IC1.7 23.5,36.08 23.5,44 v22,44 | v22,47 22,47.5 14.5,47.5 v14.5,50 14.5,48.5
N$42  (via drill 0.6)  (2 unrouted)
  Top 0.2: 14,48.5 v14,45.25
  Bottom 0.2: R1.1 14,42.75 | 14,42.5 13.75,42.75 13.75,45 v14,45.25
N$43  (via drill 0.6)
  Top 0.2: v31.76,47 30.48,47 U1.P111
  Bottom 0.2: R3.1 32,44.68 32,47 v31.76,47
N$53  (2 unrouted)
N$54  (3 unrouted)
N$55  (2 unrouted)
N$56  (3 unrouted)
N$57  (2 unrouted)
N$58  (3 unrouted)
N$59  (2 unrouted)
N$60  (3 unrouted)
N$61  (2 unrouted)
N$62  (1 unrouted)
N$63  (1 unrouted)
N$64  (1 unrouted)
N$65  (1 unrouted)
N$66  (1 unrouted)
PROM_DO  (via drill 0.6)
  Top 0.2: U1.P65 28,27.13 28,29 27,29 27,33.5 25,33.5 25,40 v28.5,40
  Bottom 0.2: v28.5,40 26.67,40 IC1.1
PROM_INITB  (via drill 0.6)  (1 unrouted)
  Top 0.2: U1.P58 24.5,27.13 v24.5,29
  Bottom 0.2: v24.5,29 24,29 24,35.5 26.5,35.5
PS2CLK  (1 unrouted)
PS2DAT  (1 unrouted)
RED
  Bottom 0.406: X2.15 81.06,33.38 80.44,32.76 79.34,32.76 JP2.5
SCART_BLUE  (3 unrouted)
SCART_COMP  (2 unrouted)
SCART_GREEN  (3 unrouted)
SCART_RED  (3 unrouted)
TCK  (1 unrouted)
  Top 0.2: JP3.1 33.96,51.96 33,51
  Bottom 0.2: R2.2 29.5,42.58 29.5,36.73 IC1.6
TMS  (1 unrouted)
  Top 0.2: JP3.2 33.77,54.77 30.5,51.5
  Bottom 0.2: R3.2 29,44.68 29,42.5 24,42.5 24,37.5 26.67,37.5 IC1.5
VCC  (via drill 0.6)  (5 unrouted)
  Top 0.2: U1.P75 32,30.08 32,32 30.55,32 | U1.P3 12.92,45.58 13.25,45.5 13.25,44 14.95,44 | 28.5,27.13 28.5,29.5 v28,30 | U$1.P8 5.54,27.04 5.5,27 | U1.P34 14.92,30.08 15,30
  Top 0.254: 14.95,37.58 12.1,37.58 U1.P19 | U1.P106 30.55,45.58 30.55,44 | U1.P91 30.55,38.08 | 28.48,28.48 U1.P66 28.5,27.13 | U1.P43 17,27.16 17,31 | U1.P138 16.98,44.02 17,44 | U1.P115 28.48,44.02 28.5,44 | U1.P126 23,48.53 23,43 | U1.P54 22.5,27.13 22.5,30 | U$1.P8 5.5,28.08
  Top 0.6: 14.95,44 14.95,37.58 14.95,34.5 | 14.95,30.08 14.95,31 | 14.95,31 14.95,34.5 | 15.03,44 17,44 v18,44 | v20.75,43.5 20.75,43 23,43 24.5,43 v24.5,43.5 | v27,44 28.5,44 30.55,44 30.55,38.08 30.55,32 30.5,32 v30.5,31.5 | 14.95,31 17,31 v18,31 | v21,31 21,30 22.5,30 25,30 v25,31 | v4.5,27 5.5,27 12,27 15,30 | v14,34.5 14.95,34.5
  Bottom 0.2: IC1.18 IC1.19 IC1.20 20,39.98 | 20,43.25 20.25,43.25 | 20.5,43.5 v20.75,43.5 | v28,30 28,31
  Bottom 0.4: 20,39.98 20,43.25
  Bottom 0.6: 20,43.25 20,44 v18,44 | v24.5,43.5 27,43.5 v27,44 | v21,31 v18,31 | 20.25,43.25 20.5,43.5 | v30.5,31.5 30.5,31 28,31 v25,31 | U$3.3 3.19,40.19 1.5,38.5 1.5,34 | 1.5,34 2,33.5 8,33.5 | 8,33.5 9,33.5 10,34.5 v14,34.5 | U$4.3 7.81,33.69 8,33.5 | v4.5,27 1.5,27 1.5,34
VCC_5V  (2 unrouted)
VCC_B2  (5 unrouted)
VCCAUX  (via drill 0.6)  (1 unrouted)
  Top 0.254: U1.P120 26,48.53 26,47 | 19,40.5 19,48.5 | U1.P62 26.5,27.13 26.5,33 | 19.48,33 U1.P48
  Top 0.4: 24.5,40.5 19,40.5 | 24.5,33 19.48,33 | 26.5,33 24.5,33 | 24.5,33 24.5,40.5 | 24.5,40.5 26,40.5 26,47 v26.5,47
  Bottom 0.4: U$3.4 8.5,46.6 8.5,47 21,47 21,45.75 24.5,45.75 24.5,47 v26.5,47
VCCINT  (via drill 0.6)  (1 unrouted)
  Top 0.2: 20,29 20,27
  Top 0.254: U1.P61 26,27.13 26,32 | U1.P133 19.48,41.52 19.5,41.5 | U1.P121 25.5,48.51 25.5,41.5 25,41.5 | v22.5,42 22.5,41.5
  Top 0.4: 22.5,32 19.98,32 19.98,29.02 20,29 v21.5,29 | 19.5,41.5 22.5,41.5 25,41.5 | 26,32 22.5,32 | 22.5,32 v22.5,31
  Bottom 0.4: v22.5,31 v22.5,42 | v21.5,29 20,28 10,28 8,30 7.4,30 U$4.4